# Altium schematic sheet P10_HDMI.SchDoc
size 386 x 246 mm
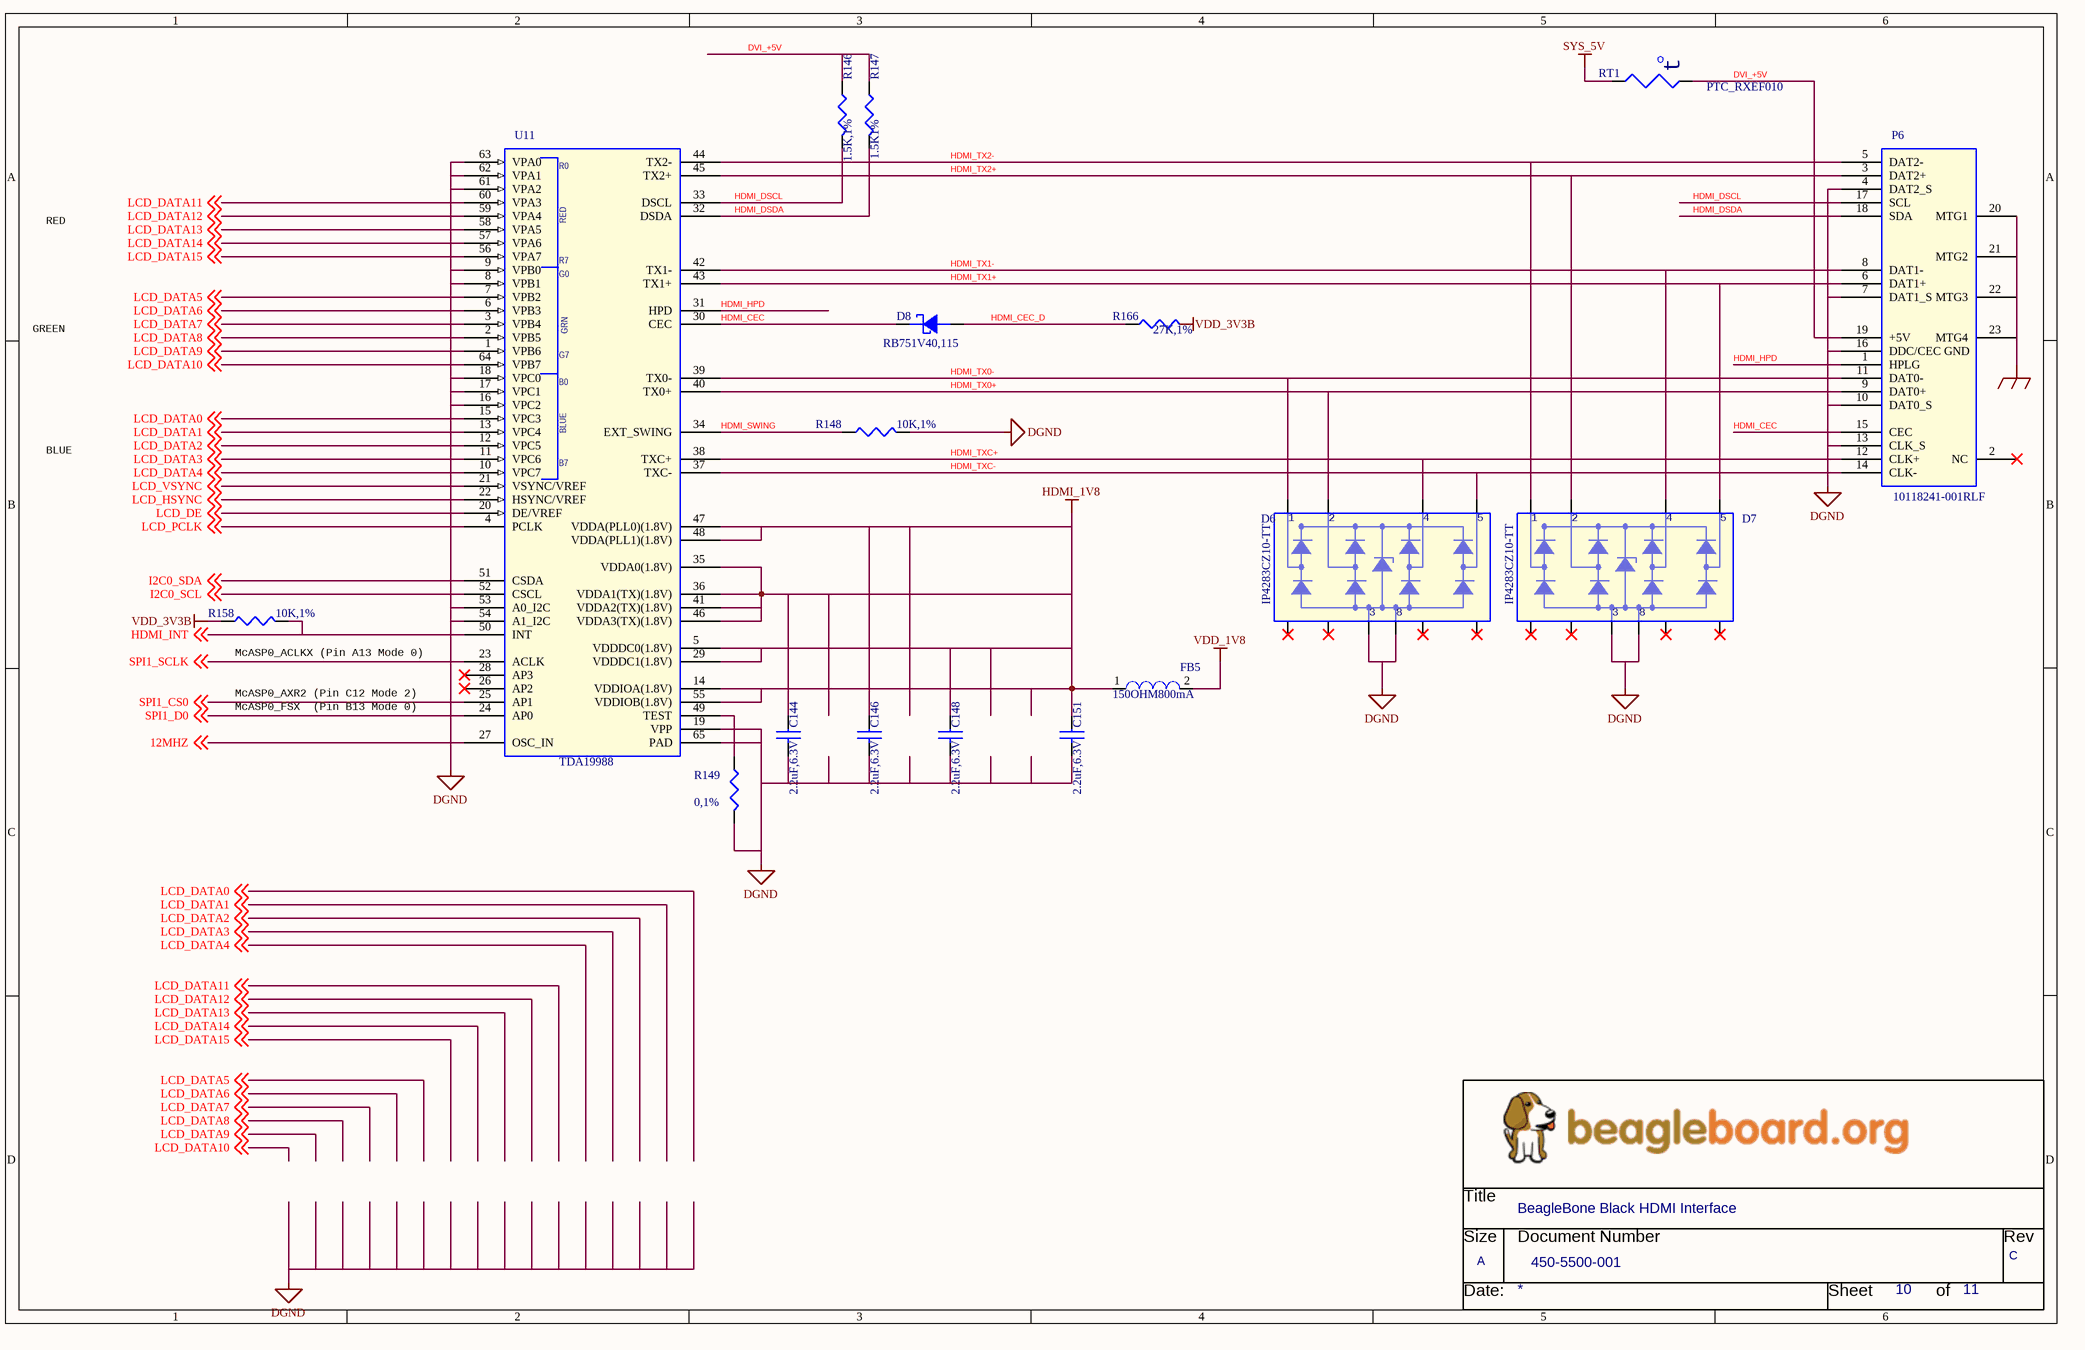
[diagram p0: P10_HDMI.SchDoc]

## Parts
*  Page Count: 11  Page Number: 10  Page Size: A  Title: BeagleBone Black HDMI Interface  RevCode: C  Doc: 450-5500-001  (hidden comment: BeagleBoard_org)  (graphical)
C144  2.2uF,6.3V  [402]
C146  2.2uF,6.3V  [402]
C148  2.2uF,6.3V  [402]
C151  2.2uF,6.3V  [402]
D6  IP4283CZ10-TT  [TSSOP10]
D7  IP4283CZ10-TT  [TSSOP10]
D8  RB751V40,115  [SOD323]
FB5  150OHM800mA  [sm-7351-ind-0805]
P6  10118241-001RLF  [hdmi-smt-w-flange]
R146  1.5K,1%  [402]
R147  1.5K1%  [402]
R148  10K,1%  [402]
R149  0,1%  [402]
R158  10K,1%  [402]
R166  27K,1%  [402]
RT1  PTC_RXEF010  [polysw200-5638-310]
U11  TDA19988  [QFN64S9X9P5]

## Nets
DGND: C144.2 C146.2 C148.2 C151.2 D6.3 D6.8 D7.3 D7.8 P6.4(DAT2_S) P6.7(DAT1_S) P6.10(DAT0_S) P6.13(CLK_S) P6.16(DDC/CEC_GND) R148.2 R149.2 U11.8(VPB1) U11.9(VPB0) U11.16(VPC2) U11.17(VPC1) U11.18(VPC0) U11.19(VPP) U11.53(A0_I2C) U11.54(A1_I2C) U11.61(VPA2) U11.62(VPA1) U11.63(VPA0) U11.65(PAD)
GND_EARTH: P6.20(MTG1) P6.21(MTG2) P6.22(MTG3) P6.23(MTG4)
HDMI_1V8: C144.1 C146.1 C148.1 C151.1 FB5.1 U11.5(VDDDC0(1.8V)) U11.14(VDDIOA(1.8V)) U11.29(VDDDC1(1.8V)) U11.35(VDDA0(1.8V)) U11.36(VDDA1(TX)(1.8V)) U11.41(VDDA2(TX)(1.8V)) U11.46(VDDA3(TX)(1.8V)) U11.47(VDDA(PLL0)(1.8V)) U11.48(VDDA(PLL1)(1.8V)) U11.55(VDDIOB(1.8V))
SYS_5V: RT1.1
VDD_1V8: FB5.2
VDD_3V3B: R158.1 R166.2
12MHZ: U11.27(OSC_IN) ; off-sheet 12MHZ
DVI_+5V: P6.19(+5V) R146.1 R147.1 RT1.2
HDMI_CEC: D8.1(CATHODE) P6.15(CEC) U11.30(CEC)
HDMI_CEC_D: D8.2(ANODE) R166.1
HDMI_DSCL: P6.17(SCL) R146.2 U11.33(DSCL)
HDMI_DSDA: P6.18(SDA) R147.2 U11.32(DSDA)
HDMI_HPD: P6.1(HPLG) U11.31(HPD)
HDMI_INT: R158.2 U11.50(INT) ; off-sheet HDMI_INT
HDMI_SWING: R148.1 U11.34(EXT_SWING)
HDMI_TX0+: D6.2 P6.9(DAT0+) U11.40(TX0+)
HDMI_TX0-: D6.1 P6.11(DAT0-) U11.39(TX0-)
HDMI_TX1+: D7.5 P6.6(DAT1+) U11.43(TX1+)
HDMI_TX1-: D7.4 P6.8(DAT1-) U11.42(TX1-)
HDMI_TX2+: D7.2 P6.3(DAT2+) U11.45(TX2+)
HDMI_TX2-: D7.1 P6.5(DAT2-) U11.44(TX2-)
HDMI_TXC+: D6.4 P6.12(CLK+) U11.38(TXC+)
HDMI_TXC-: D6.5 P6.14(CLK-) U11.37(TXC-)
I2C0_SCL: U11.52(CSCL) ; off-sheet I2C0_SCL
I2C0_SDA: U11.51(CSDA) ; off-sheet I2C0_SDA
LCD_DATA0: U11.15(VPC3) ; off-sheet LCD_DATA0
LCD_DATA1: U11.13(VPC4) ; off-sheet LCD_DATA1
LCD_DATA2: U11.12(VPC5) ; off-sheet LCD_DATA2
LCD_DATA3: U11.11(VPC6) ; off-sheet LCD_DATA3
LCD_DATA4: U11.10(VPC7) ; off-sheet LCD_DATA4
LCD_DATA5: U11.7(VPB2) ; off-sheet LCD_DATA5
LCD_DATA6: U11.6(VPB3) ; off-sheet LCD_DATA6
LCD_DATA7: U11.3(VPB4) ; off-sheet LCD_DATA7
LCD_DATA8: U11.2(VPB5) ; off-sheet LCD_DATA8
LCD_DATA9: U11.1(VPB6) ; off-sheet LCD_DATA9
LCD_DATA10: U11.64(VPB7) ; off-sheet LCD_DATA10
LCD_DATA11: U11.60(VPA3) ; off-sheet LCD_DATA11
LCD_DATA12: U11.59(VPA4) ; off-sheet LCD_DATA12
LCD_DATA13: U11.58(VPA5) ; off-sheet LCD_DATA13
LCD_DATA14: U11.57(VPA6) ; off-sheet LCD_DATA14
LCD_DATA15: U11.56(VPA7) ; off-sheet LCD_DATA15
LCD_DE: U11.20(DE/VREF) ; off-sheet LCD_DE
LCD_HSYNC: U11.22(HSYNC/VREF) ; off-sheet LCD_HSYNC
LCD_PCLK: U11.4(PCLK) ; off-sheet LCD_PCLK
LCD_VSYNC: U11.21(VSYNC/VREF) ; off-sheet LCD_VSYNC
SPI1_CS0: U11.25(AP1) ; off-sheet SPI1_CS0
SPI1_D0: U11.24(AP0) ; off-sheet SPI1_D0
SPI1_SCLK: U11.23(ACLK) ; off-sheet SPI1_SCLK
NetR149_1: R149.1 U11.49(TEST)

Not connected (* = marked no-connect by the designer): D6 6* 7* 9* 10*; D7 6* 7* 9* 10*; P6 2(NC)*; U11 26(AP2)* 28(AP3)*

## Notes on the sheet
- RED
- GREEN
- BLUE
- (near R158) McASP0_ACLKX (Pin A13 Mode 0)
- McASP0_AXR2 (Pin C12 Mode 2)
- McASP0_FSX  (Pin B13 Mode 0)
- (in symbol BeagleBoard_org) Title; Size; Document Number; Rev; Date:; Sheet; of
- (in symbol IC_TDA19988_HVQFN64_5) R0; RED; R7; G0; GRN; G7; B0; BLUE; B7
- (in symbol PTC_RXEF010) t

## Library data of the parts
C144 C146 C148 C151 = CAP_2.2uF_X5R_6.3V_10%_0402: Desc: CAP, CER, X7R, 0402, 50V, 10%, 0.1uF; Part Number: CAP_2.2uF_X5R_6.3V_10%_0402; PCB Footprint: 402
D6 D7 = 32CTQ030/TO_1: PCB Footprint: TSSOP10
D8 = DIO_SR305_TH_0: Part Number: DIO_SR305_TH; PCB Footprint: SOD323
FB5 = FER_180_200_0805: Ferrite Bead 150 Ohm 800mA; TIIntPartnumber: 1L0010; MfrNum: LI0805H151R-10; Mfr: Steward; PCB Footprint: 805; Vendor: Digikey; Part Number: FER_180_200_0805; PartName: FerriteBead150ohm800mA
P6 = CONN_HDMI_TYPED: PCB Footprint: CONN19_HDMI
R146 R147 = RES_1.5K_1/16W_5%_0402: RES 1.5K OHM 1/16W 5% 0402 SMD; Part Number: RES_1.5K_1/16W_5%_0402; PCB Footprint: 402
R148 R158 = RES_10K_1/16W_1%_0402: Resistor 10Kohm 1/16W 1% 0402; Part Number: RES_10K_1/16W_1%_0402; PCB Footprint: 402
R149 = RES_0_1/16W_1%_0402: Resistor Zero ohm Jumper 0402; Part Number: RES_0_1/16W_1%_0402; PCB Footprint: 402
R166 = RES_22.6K_1/16W_1%_0402: RES 22.6K OHM 1/16W 1% SMD 0402; Part Number: RES_22.2K_1/16W_1%_0402; PCB Footprint: 402
U11 = IC_TDA19988_HVQFN64_5: PCB Footprint: QFN64S9X9P5
* = BeagleBoard_org: Page Create Date: March  8, 1995; Page Modify Date: *
RT1 = PTC_RXEF010: PCB Footprint: polysw200-5638-310